# Altium project 磁悬浮.PrjPcb
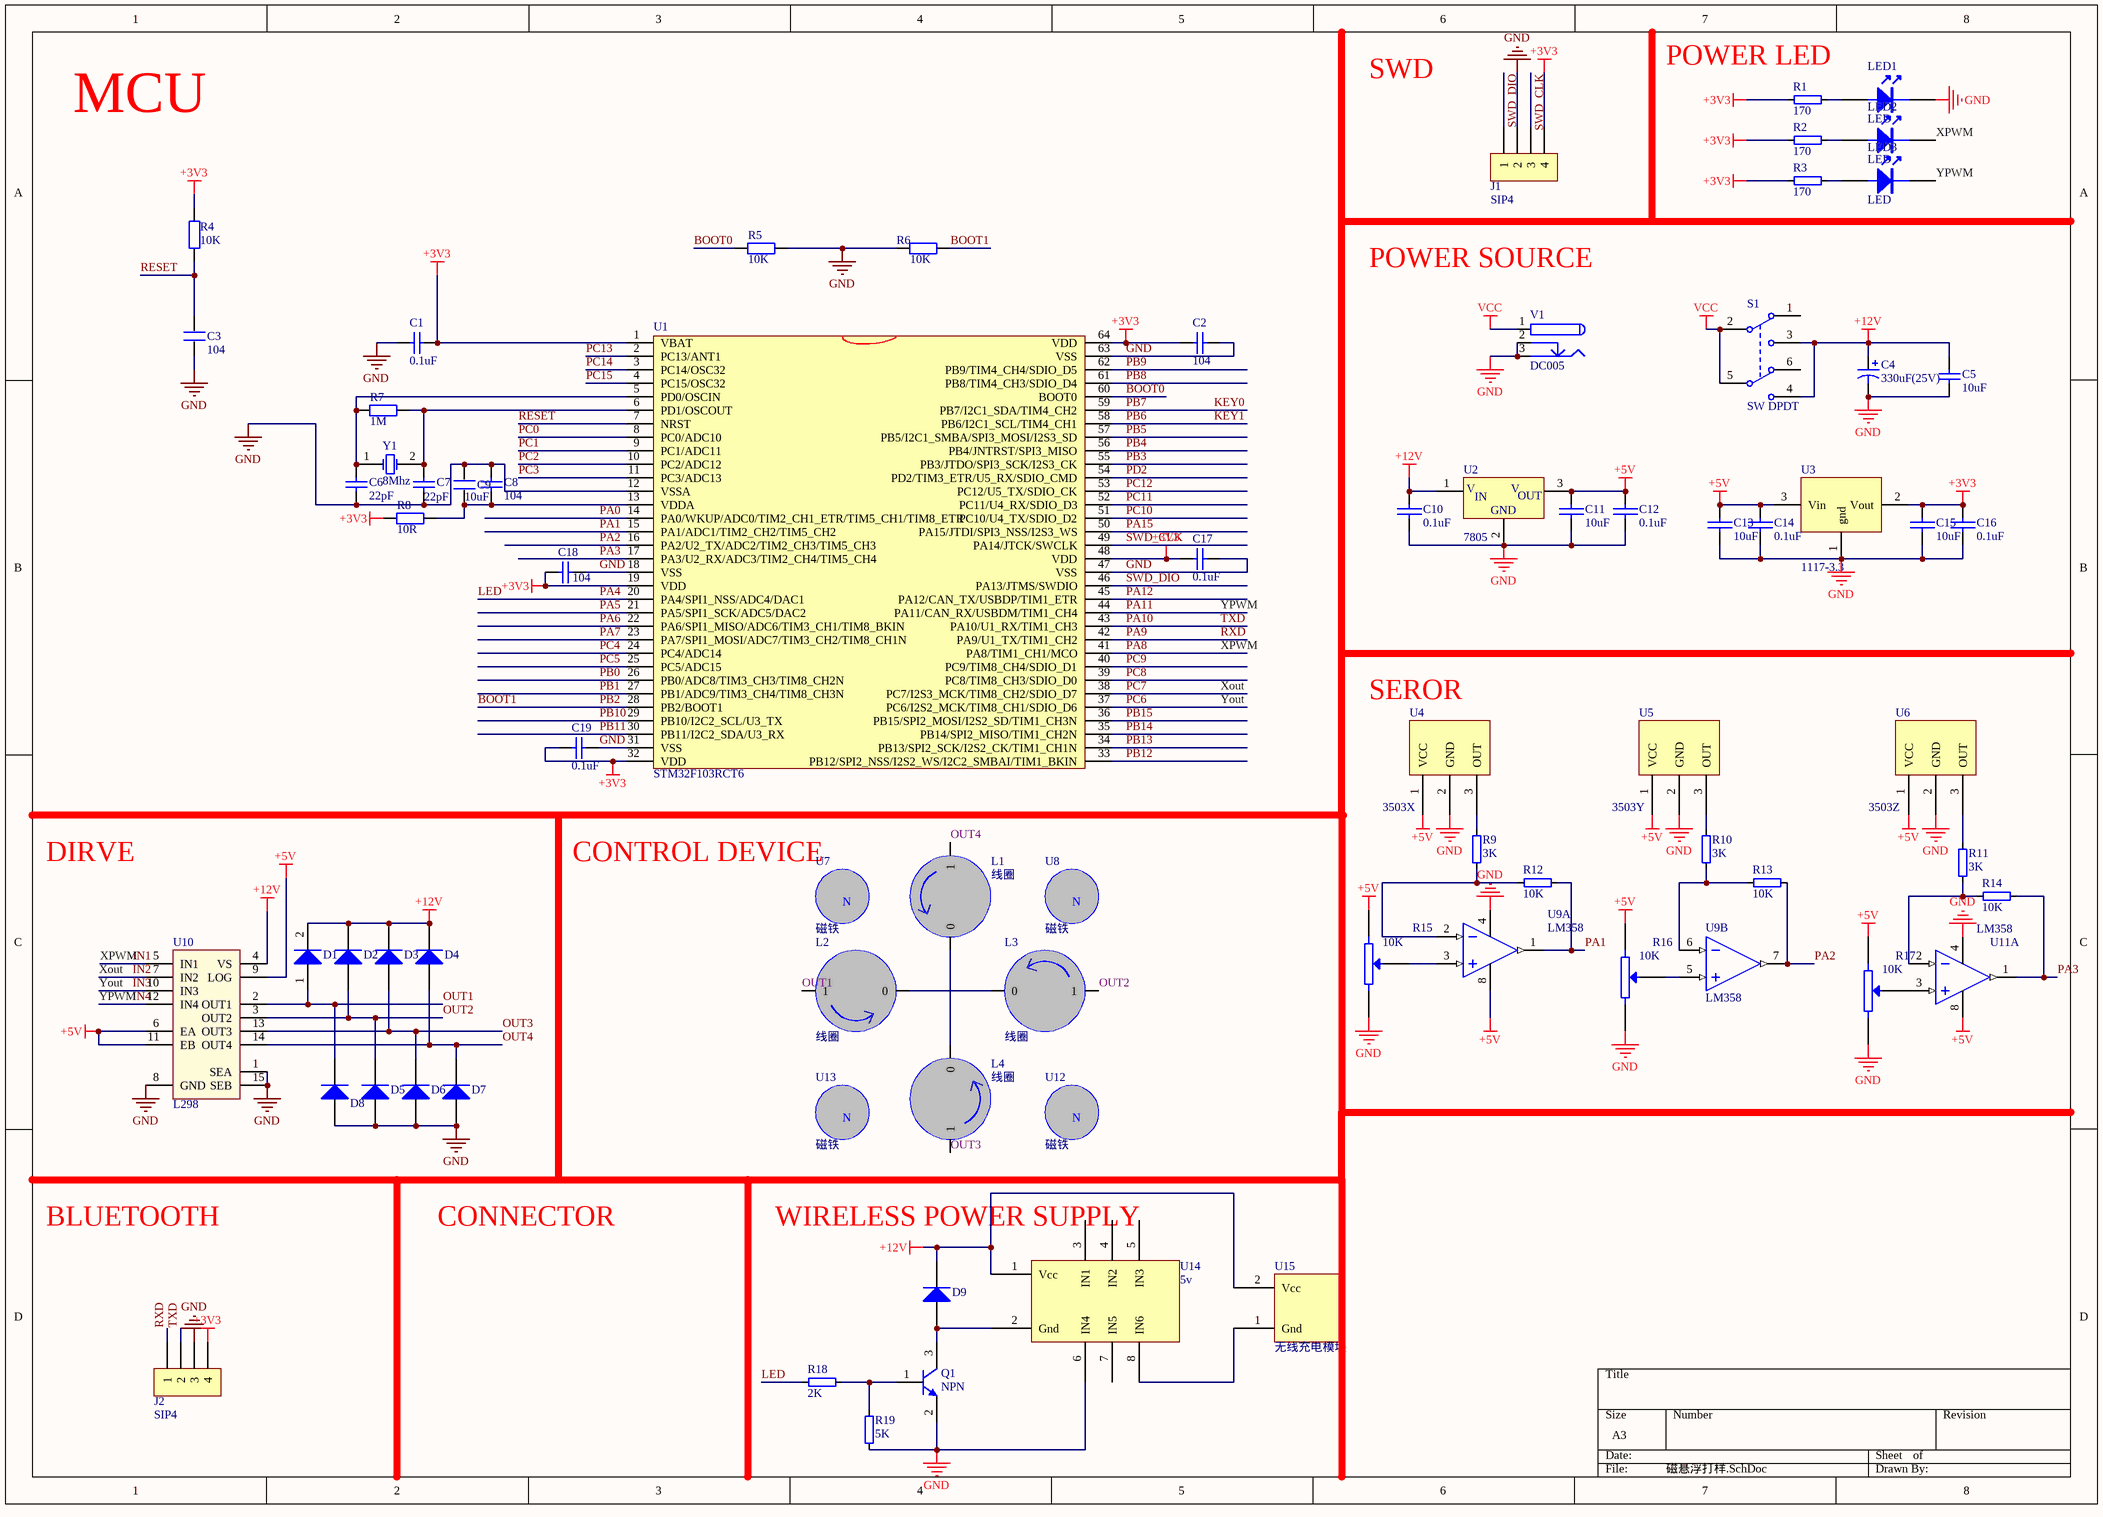
[diagram p0: 磁悬浮打样.SchDoc]
1 sheet, 75 parts. Net scope: global (net labels, ports and power ports of the same name join across sheets).
Board file: 磁悬浮打样.PcbDoc

## Sheet 磁悬浮打样.SchDoc
size A3

### Parts
C1  value 0.1uF  [CAP_0805]  (hidden comment: Cap)
C2  value 104  [CAP_0805]  (hidden comment: Cap)
C3  104  [CAP_0805]
C4  value 330uF(25V)  [CAP_ELEC_AL_6.3x4.2]  (hidden comment: Cap Pol1)
C5  value 10uF  [CAP_0805]  (hidden comment: Cap)
C6  value 22pF  [CAP_0805]  (hidden comment: Cap)
C7  value 22pF  [CAP_0805]  (hidden comment: Cap)
C8  value 104  [CAP_0805]  (hidden comment: Cap)
C9  10uF  [CAP_0805]
C10  0.1uF  [CAP_0805]
C11  10uF  [CAP_0805]
C12  0.1uF  [CAP_0805]
C13  10uF  [CAP_0805]
C14  0.1uF  [CAP_0805]
C15  10uF  [CAP_0805]
C16  0.1uF  [CAP_0805]
C17  value 0.1uF  [CAP_0805]  (hidden comment: Cap)
C18  value 104  [CAP_0805]  (hidden comment: Cap)
C19  value 0.1uF  [CAP_0805]  (hidden comment: Cap)
D1  Diode  [1N5819]  (value not drawn)
D2  Diode  [1N5819]  (value not drawn)
D3  Diode  [1N5819]  (value not drawn)
D4  Diode  [1N5819]  (value not drawn)
D5  Diode  [1N5819]  (value not drawn)
D6  Diode  [1N5819]  (value not drawn)
D7  Diode  [1N5819]  (value not drawn)
D8  Diode  [1N5819]  (value not drawn)
D9  Diode  [1N5819]  (value not drawn)
J1  SIP4  [HDR1X4_180_2.54]
J2  SIP4  [SIP4 H]
L1  线圈  [线圈]
L2  线圈  [线圈]
L3  线圈  [线圈]
L4  线圈  [线圈]
LED1  LED  [LED0805蓝]
LED2  LED  [LED0805蓝]
LED3  LED  [LED0805蓝]
Q1  NPN  [SOT23-3]
R1  170  [RES_0805]
R2  170  [RES_0805]
R3  170  [RES_0805]
R4  value 10K  [RES_0805]  (hidden comment: Res2)
R5  value 10K  [RES_0805]  (hidden comment: Res2)
R6  value 10K  [RES_0805]  (hidden comment: Res2)
R7  value 1M  [RES_0805]  (hidden comment: Res2)
R8  value 10R  [RES_0805]  (hidden comment: Res2)
R9  3K  [RES_0805]
R10  3K  [RES_0805]
R11  3K  [RES_0805]
R12  10K  [RES_0805]
R13  10K  [RES_0805]
R14  10K  [RES_0805]
R15  10K  [VR]
R16  10K  [VR]
R17  10K  [VR]
R18  2K  [RES_0805]
R19  5K  [RES_0805]
S1  SW DPDT  [SW6]
U1  STM32F103RCT6  [LQFP64_L]
U2  7805  [TO-220]
U3  1117-3.3  [SOT223]
U4  3503X  [TO-92UA]
U5  3503Y  [TO-92UA]
U6  3503Z  [TO-92UA]
U7  磁铁  [磁铁]
U8  磁铁  [磁铁]
U9  LM358  [SOIC-8]  (parts A,B of 2)
U10  L298  [L298N]
U11  LM358  [SOIC-8]  (part A of 2)
U12  磁铁  [磁铁]
U13  磁铁  [磁铁]
U14  5v  [relay-5v]
U15  无线充电模块  [无线充电模块]
V1  DC005  [DC-005]
Y1  8Mhz  [crystal]

### Nets
+3V3: C1.2 C2.1 C15.1 C16.1 C17.1 C18.1 C19.1 J1.4 J2.4 R1.1 R2.1 R3.1 R4.2 R8.1 U1.1(VBAT) U1.19(VDD) U1.32(VDD) U1.48(VDD) U1.64(VDD) U3.2(Vout)
+5V: C11.1 C12.1 C13.1 C14.1 R15.1 R16.1 R17.1 U2.3(VOUT) U3.3(Vin) U4.1(VCC) U5.1(VCC) U6.1(VCC) U9.8(V+) U10.6(EA) U10.9(LOG) U10.11(EB) U11.8(V+)
+12V: C4.1 C5.2 C10.1 D1.2(K) D2.2(K) D3.2(K) D4.2(K) D9.2(K) S1.3(NO1) S1.4(NO2) U2.1(VIN) U10.4(VS) U14.1(Vcc) U15.2(Vcc)
GND: C1.1 C2.2 C3.1 C4.2 C5.1 C6.1 C7.1 C8.2 C9.2 C10.2 C11.2 C12.2 C13.2 C14.2 C15.2 C16.2 C17.2 C18.2 C19.2 D5.1(A) D6.1(A) D7.1(A) D8.1(A) J1.2 J2.3 LED1.K Q1.2(E) R5.2 R6.1 R15.2 R16.2 R17.2 R19.2 U1.12(VSSA) U1.18(VSS) U1.31(VSS) U1.47(VSS) U1.63(VSS) U2.2(GND) U3.1(gnd) U4.2(GND) U5.2(GND) U6.2(GND) U9.4(V-) U10.1(SEA) U10.8(GND) U10.15(SEB) U11.4(V-) U14.6(IN4) V1.2(3B) V1.3
VCC: S1.2(COMMON1) S1.5(COMMON2) V1.1
BOOT0: R5.1 U1.60(BOOT0)
BOOT1: R6.2 U1.28(PB2/BOOT1)  [also labelled PB2]
IN1: LED2.K U1.41(PA8/TIM1_CH1/MCO) U10.5(IN1)  [also labelled PA8, XPWM]
IN2: U1.38(PC7/I2S3_MCK/TIM8_CH2/SDIO_D7) U10.7(IN2)  [also labelled PC7, Xout]
IN3: U1.37(PC6/I2S2_MCK/TIM8_CH1/SDIO_D6) U10.10(IN3)  [also labelled PC6, Yout]
IN4: LED3.K U1.44(PA11/CAN_RX/USBDM/TIM1_CH4) U10.12(IN4)  [also labelled PA11, YPWM]
KEY0: U1.59(PB7/I2C1_SDA/TIM4_CH2)  [also labelled PB7]
KEY1: U1.58(PB6/I2C1_SCL/TIM4_CH1)  [also labelled PB6]
LED: R18.2 U1.20(PA4/SPI1_NSS/ADC4/DAC1)  [also labelled PA4]
OUT1: D1.1(A) D8.2(K) L2.1 U10.2(OUT1)
OUT2: D2.1(A) D5.2(K) L3.1 U10.3(OUT2)
OUT3: D3.1(A) D6.2(K) L4.1 U10.13(OUT3)
OUT4: D4.1(A) D7.2(K) L1.1 U10.14(OUT4)
PA0: U1.14(PA0/WKUP/ADC0/TIM2_CH1_ETR/TIM5_CH1/TIM8_ETR)
PA1: R12.1 U1.15(PA1/ADC1/TIM2_CH2/TIM5_CH2) U9.1(OUT)
PA2: R13.1 U1.16(PA2/U2_TX/ADC2/TIM2_CH3/TIM5_CH3) U9.7(OUT)
PA3: R14.1 U1.17(PA3/U2_RX/ADC3/TIM2_CH4/TIM5_CH4) U11.1(OUT)
PA5: U1.21(PA5/SPI1_SCK/ADC5/DAC2)
PA6: U1.22(PA6/SPI1_MISO/ADC6/TIM3_CH1/TIM8_BKIN)
PA7: U1.23(PA7/SPI1_MOSI/ADC7/TIM3_CH2/TIM8_CH1N)
PA9: J2.1 U1.42(PA9/U1_TX/TIM1_CH2)  [also labelled RXD]
PA10: J2.2 U1.43(PA10/U1_RX/TIM1_CH3)  [also labelled TXD]
PA12: U1.45(PA12/CAN_TX/USBDP/TIM1_ETR)
PA15: U1.50(PA15/JTDI/SPI3_NSS/I2S3_WS)
PB0: U1.26(PB0/ADC8/TIM3_CH3/TIM8_CH2N)
PB1: U1.27(PB1/ADC9/TIM3_CH4/TIM8_CH3N)
PB3: U1.55(PB3/JTDO/SPI3_SCK/I2S3_CK)
PB4: U1.56(PB4/JNTRST/SPI3_MISO)
PB5: U1.57(PB5/I2C1_SMBA/SPI3_MOSI/I2S3_SD)
PB8: U1.61(PB8/TIM4_CH3/SDIO_D4)
PB9: U1.62(PB9/TIM4_CH4/SDIO_D5)
PB10: U1.29(PB10/I2C2_SCL/U3_TX)
PB11: U1.30(PB11/I2C2_SDA/U3_RX)
PB12: U1.33(PB12/SPI2_NSS/I2S2_WS/I2C2_SMBAI/TIM1_BKIN)
PB13: U1.34(PB13/SPI2_SCK/I2S2_CK/TIM1_CH1N)
PB14: U1.35(PB14/SPI2_MISO/TIM1_CH2N)
PB15: U1.36(PB15/SPI2_MOSI/I2S2_SD/TIM1_CH3N)
PC0: U1.8(PC0/ADC10)
PC1: U1.9(PC1/ADC11)
PC2: U1.10(PC2/ADC12)
PC3: U1.11(PC3/ADC13)
PC4: U1.24(PC4/ADC14)
PC5: U1.25(PC5/ADC15)
PC8: U1.39(PC8/TIM8_CH3/SDIO_D0)
PC9: U1.40(PC9/TIM8_CH4/SDIO_D1)
PC10: U1.51(PC10/U4_TX/SDIO_D2)
PC11: U1.52(PC11/U4_RX/SDIO_D3)
PC12: U1.53(PC12/U5_TX/SDIO_CK)
PC13: U1.2(PC13/ANT1)
PC14: U1.3(PC14/OSC32)
PC15: U1.4(PC15/OSC32)
PD2: U1.54(PD2/TIM3_ETR/U5_RX/SDIO_CMD)
RESET: C3.2 R4.1 U1.7(NRST)
SWD_CLK: J1.3 U1.49(PA14/JTCK/SWCLK)
SWD_DIO: J1.1 U1.46(PA13/JTMS/SWDIO)
NetC6_2: C6.2 R7.1 U1.5(PD0/OSCIN) Y1.1(OSC1)
NetC7_2: C7.2 R7.2 U1.6(PD1/OSCOUT) Y1.2(OSC2)
NetC8_1: C8.1 C9.1 R8.2 U1.13(VDDA)
NetD9_1: D9.1(A) Q1.3(C) U14.2(Gnd)
NetL1_0: L1.0 L4.0
NetL2_0: L2.0 L3.0
NetLED1_A: LED1.A R1.2
NetLED2_A: LED2.A R2.2
NetLED3_A: LED3.A R3.2
NetQ1_1: Q1.1(B) R18.1 R19.1
NetR9_1: R9.1 R12.2 U9.2(IN-)
NetR9_2: R9.2 U4.3(OUT)
NetR10_1: R10.1 R13.2 U9.6(IN-)
NetR10_2: R10.2 U5.3(OUT)
NetR11_1: R11.1 R14.2 U11.2(IN-)
NetR11_2: R11.2 U6.3(OUT)
NetR15_3: R15.3(W) U9.3(IN+)
NetR16_3: R16.3(W) U9.5(IN+)
NetR17_3: R17.3(W) U11.3(IN+)
NetU14_8: U14.8(IN6) U15.1(Gnd)

Not connected (* = marked no-connect by the designer): S1 1(NC1) 6(NC2); U14 3(IN1) 4(IN2) 5(IN3) 7(IN5)

### Notes on the sheet
- SWD
- (near R1) POWER LED
- MCU
- POWER SOURCE
- SEROR
- DIRVE
- CONTROL DEVICE
- BLUETOOTH
- CONNECTOR
- (near U14) WIRELESS POWER SUPPLY
- (in symbol 7812) V; IN; OUT
- (in symbol 磁铁) N

### Library data of the parts
C1 = Cap: Capacitor; Published: 8-Jun-2000; LatestRevisionDate: 17-Jul-2002; LatestRevisionNote: Re-released for DXP Platform.; PackageReference: RAD-0.3; Publisher: Altium Limited; PackageDescription: Radial Cap, Thru-Hole; 2 Leads; 0.3 in Pin Spacing
C2 C17-C19 = Cap_1: Capacitor; Published: 8-Jun-2000; LatestRevisionDate: 17-Jul-2002; LatestRevisionNote: Re-released for DXP Platform.; PackageReference: RAD-0.3; Publisher: Altium Limited; PackageDescription: Radial Cap, Thru-Hole; 2 Leads; 0.3 in Pin Spacing
C3 C9 = C
C4 = Cap Pol1_1: Polarized Capacitor (Radial); Published: 8-Jun-2000; LatestRevisionDate: 17-Jul-2002; LatestRevisionNote: Re-released for DXP Platform.; PackageReference: RB7.6-15; Publisher: Altium Limited; PackageDescription: Polarized Capacitor (Radial); 2 Leads
C5 = Cap_2: Capacitor; Published: 8-Jun-2000; LatestRevisionDate: 17-Jul-2002; LatestRevisionNote: Re-released for DXP Platform.; PackageReference: RAD-0.3; Publisher: Altium Limited; PackageDescription: Radial Cap, Thru-Hole; 2 Leads; 0.3 in Pin Spacing
C6-C8 = Cap_3: Capacitor; Published: 8-Jun-2000; LatestRevisionDate: 17-Jul-2002; LatestRevisionNote: Re-released for DXP Platform.; PackageReference: RAD-0.3; Publisher: Altium Limited; PackageDescription: Radial Cap, Thru-Hole; 2 Leads; 0.3 in Pin Spacing
C10-C16 = CAP
D1-D9 = Diode: Default Diode; Published: 8-Jun-2000; LatestRevisionDate: 17-Jul-2002; LatestRevisionNote: Re-released for DXP Platform.; PackageVersion: Sep-1996; PackageReference: SMC; Publisher: Altium Limited; Code_JEDEC: DO-214-AB
J1 J2 = SIP4: jointbar
Q1 = NPN1: 贴片三极管; Published: 8-Jun-2000; LatestRevisionDate: 15-Jan-2003; LatestRevisionNote: PCB Footprint 'BCY-W3/D4.7' replaced; DatasheetDocument: 1997; PackageDocument: Sep-1998; PackageReference: TO-92A; Publisher: Altium Limited; Code_JEDEC: TO-92A; ComponentLink1Description: Manufacturer Link; ComponentLink1URL: http://www.fairchildsemi.com/; ComponentLink2Description: Datasheet; ComponentLink2URL: http://www.fairchildsemi.com/ds/2N%2F2N3904.pdf
R1-R3 R9-R14 R18 R19 = RESistor
R4 R8 = Res2_1: Resistor; Published: 8-Jun-2000; LatestRevisionDate: 17-Jul-2002; LatestRevisionNote: Re-released for DXP Platform.; PackageReference: AXIAL-0.4; Publisher: Altium Limited; PackageDescription: Axial Device, Thru-Hole; 2 Leads; 0.4 in Pin Spacing
R5-R7 = Res2: Resistor; Published: 8-Jun-2000; LatestRevisionDate: 17-Jul-2002; LatestRevisionNote: Re-released for DXP Platform.; PackageReference: AXIAL-0.4; Publisher: Altium Limited; PackageDescription: Axial Device, Thru-Hole; 2 Leads; 0.4 in Pin Spacing
R15-R17 = RESVR: Potentiometer
S1 = SW DPDT: Switch; Published: 24-Mar-1999; LatestRevisionDate: 17-Jul-2002; LatestRevisionNote: Re-released for DXP Platform.; PackageReference: SOT23-6; Publisher: Altium Limited
U1 = STM32F103RDT6
U2 = 7812
U3 = 1117
U4-U6 = 3503
U9 U11 = LM358: 双运放
U14 = relay-5V
U15 = 无线充电
Y1 = XTAL: Crystal Oscillator; Published: 8-Jun-2000; LatestRevisionDate: 17-Jul-2002; LatestRevisionNote: Re-released for DXP Platform.; PackageReference: R38; Publisher: Altium Limited; PackageDescription: Crystal, Thru-Hole; 2 Leads; Body 3.1 x 8.2 mm (Dia.xH)